# Altium schematic sheet Main.SchDoc
size A4
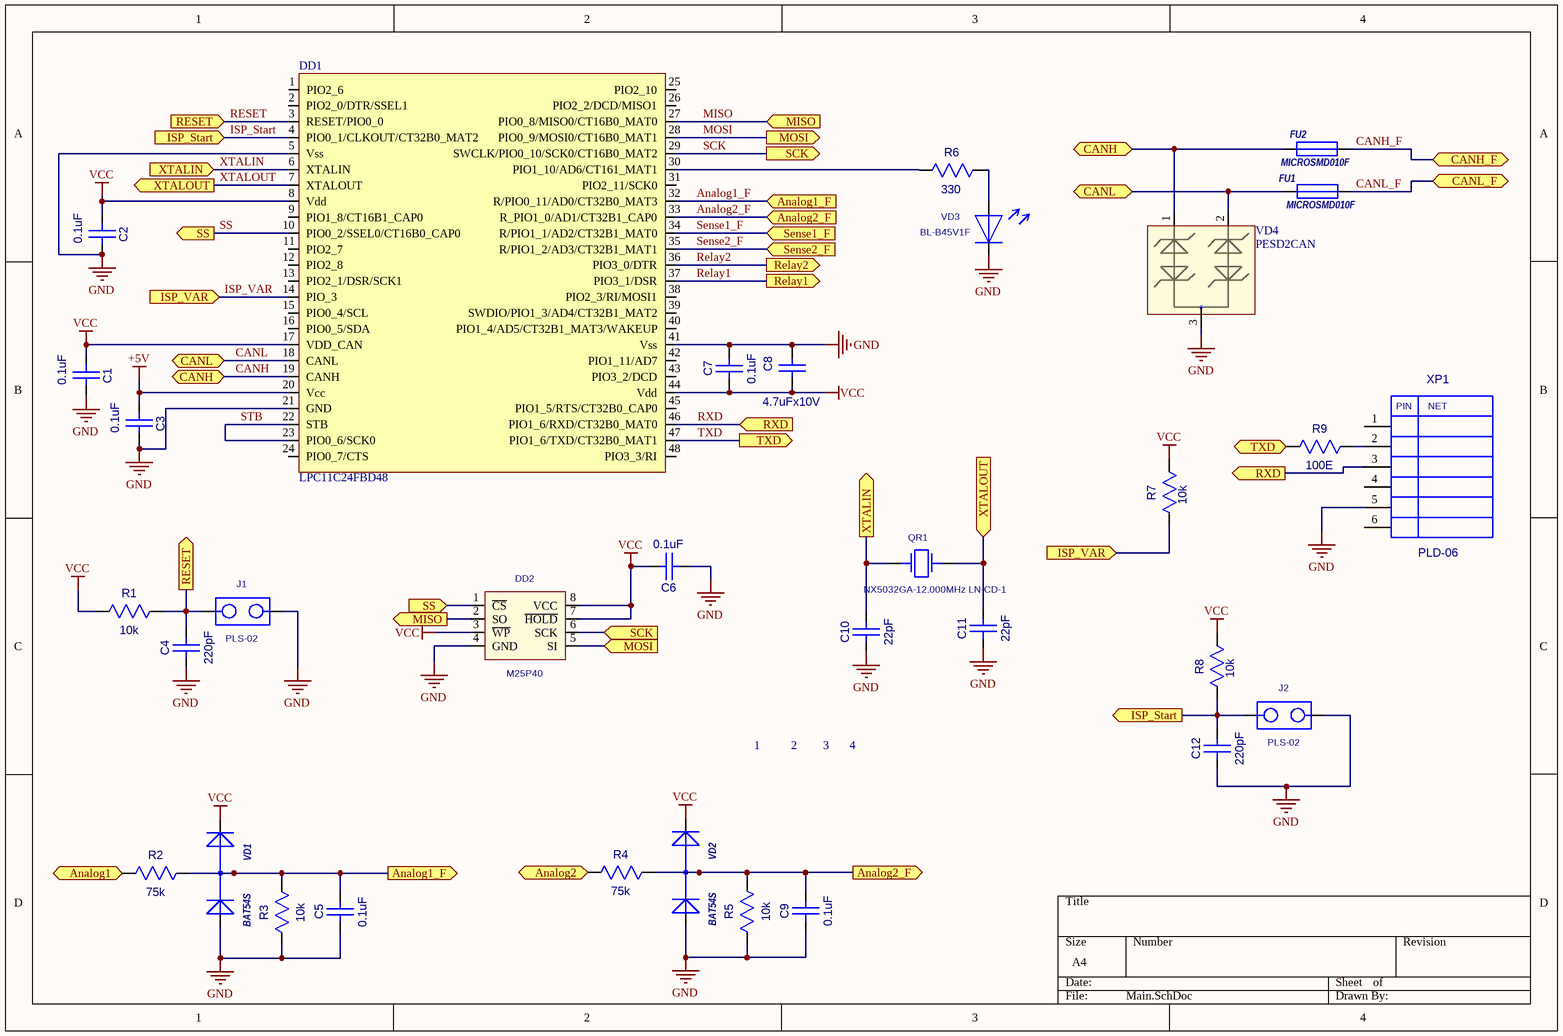
[diagram p0: Main.SchDoc]

## Parts
1  REPER1.2  [REPER1.2]  (value not drawn)
2  REPER1.2  [REPER1.2]  (value not drawn)
3  REPER1.2  [REPER1.2]  (value not drawn)
4  REPER1.2  [REPER1.2]  (value not drawn)
C1  0.1uF  [CC0603-3M]
C2  0.1uF  [CC0603-3M]
C3  0.1uF  [CC0603-3M]
C4  220pF  [CC0603-3M]
C5  0.1uF  [CC0603-3M]
C6  0.1uF  [CC0603-3M]
C7  0.1uF  [CC0603-3M]
C8  4.7uFx10V  [CC0805-MIDI-2M1]
C9  0.1uF  [CC0603-3M]
C10  22pF  [CC0603-3M]
C11  22pF  [CC0603-3M]
C12  220pF  [CC0603-3M]
DD1  LPC11C24FBD48  [LQFP-48]
DD2  M25P40  [EIAJ_SO8]
FU1  MICROSMD010F  [RC1210]
FU2  MICROSMD010F  [RC1210]
J1  PLS-02  [PLS-02]
J2  PLS-02  [PLS-02]
QR1  NX5032GA-12.000MHz LN-CD-1  [AC5032_2]
R1  10k  [RC0603-3M]
R2  75k  [RC0603-3M]
R3  10k  [RC0603-3M]
R4  75k  [RC0603-3M]
R5  10k  [RC0603-3M]
R6  330  [RC0603-3M]
R7  10k  [RC0603-3M]
R8  10k  [RC0603-3M]
R9  100E  [RC0603-3M]
VD1  BAT54S  [SOT-23(GSD)]
VD2  BAT54S  [SOT-23(GSD)]
VD3  BL-B45V1F  [LED3]
VD4  PESD2CAN  [SOT-23(123)]
XP1  PLD-06  [PIN6]

## Ports
Analog1 (in), Analog1_F (in), Analog1_F (out), Analog2 (in), Analog2_F (in), Analog2_F (out), CANH, CANH_F, CANL, CANL_F, ISP_Start (in), ISP_Start (out), ISP_VAR (in), MISO (in), MISO (out), MOSI (in), MOSI (out), Relay1 (out), Relay2 (out), RESET (in), RESET (out), RXD (in), RXD (out), SCK (in), SCK (out), Sense1_F (in), Sense2_F (in), SS (in), SS (out), TXD (in), TXD (out), XTALIN (in), XTALIN (out), XTALOUT (in), XTALOUT (out)

## Nets
+5V: C3.1(A) DD1.20(Vcc)
GND: C1.2(B) C2.2(B) C3.2(B) C4.1(A) C5.1(A) C6.1(A) C7.2(B) C8.2(B) C9.1(A) C10.1(A) C11.1(A) C12.1(A) DD1.5(Vss) DD1.21(GND) DD1.41(Vss) DD2.4(GND) J1.2 J2.2 R3.1(A) R5.1(A) VD1.1(A) VD2.1(A) VD3.1 VD4.3 XP1.5
VCC: C1.1(A) C2.1(A) C6.2(B) C7.1(A) C8.1(A) DD1.8(Vdd) DD1.17(VDD_CAN) DD1.44(Vdd) DD2.3(~{WP}) DD2.7(~{HOLD}) DD2.8(VCC) R1.1(A) R7.2(B) R8.2(B) VD1.2(K) VD2.2(K)
Analog1: R2.1(A) ; port Analog1
Analog1_F: C5.2(B) DD1.32(R/PIO0_11/AD0/CT32B0_MAT3) R2.2(B) R3.2(B) VD1.3(AK) ; port Analog1_F
Analog2: R4.1(A) ; port Analog2
Analog2_F: C9.2(B) DD1.33(R_PIO1_0/AD1/CT32B1_CAP0) R4.2(B) R5.2(B) VD2.3(AK) ; port Analog2_F
CANH: DD1.19(CANH) FU2.1 VD4.1 ; port CANH
CANH_F: FU2.2 ; port CANH_F
CANL: DD1.18(CANL) FU1.1 VD4.2 ; port CANL
CANL_F: FU1.2 ; port CANL_F
ISP_Start: C12.2(B) DD1.4(PIO0_1/CLKOUT/CT32B0_MAT2) J2.1 R8.1(A) ; port ISP_Start
ISP_VAR: DD1.14(PIO_3) R7.1(A) ; port ISP_VAR
MISO: DD1.27(PIO0_8/MISO0/CT16B0_MAT0) DD2.2(SO) ; port MISO
MOSI: DD1.28(PIO0_9/MOSI0/CT16B0_MAT1) DD2.5(SI) ; port MOSI
Relay1: DD1.37(PIO3_1/DSR) ; port Relay1
Relay2: DD1.36(PIO3_0/DTR) ; port Relay2
RESET: C4.2(B) DD1.3(RESET/PIO0_0) J1.1 R1.2(B) ; port RESET
RXD: DD1.46(PIO1_6/RXD/CT32B0_MAT0) XP1.3 ; port RXD
SCK: DD1.29(SWCLK/PIO0_10/SCK0/CT16B0_MAT2) DD2.6(SCK) ; port SCK
Sense1_F: DD1.34(R/PIO1_1/AD2/CT32B1_MAT0) ; port Sense1_F
Sense2_F: DD1.35(R/PIO1_2/AD3/CT32B1_MAT1) ; port Sense2_F
SS: DD1.10(PIO0_2/SSEL0/CT16B0_CAP0) DD2.1(~{CS}) ; port SS
STB: DD1.22(STB) DD1.23(PIO0_6/SCK0)
TXD: DD1.47(PIO1_6/TXD/CT32B0_MAT1) R9.1(A) ; port TXD
XTALIN: C10.2(B) DD1.6(XTALIN) QR1.1 ; port XTALIN
XTALOUT: C11.2(B) DD1.7(XTALOUT) QR1.2 ; port XTALOUT
NetDD1_30: DD1.30(PIO1_10/AD6/CT161_MAT1) R6.1(A)
NetR6_2: R6.2(B) VD3.2
NetR9_2: R9.2(B) XP1.2

Not connected (* = marked no-connect by the designer): 1 1; 2 1; 3 1; 4 1; DD1 1(PIO2_6) 2(PIO2_0/DTR/SSEL1) 9(PIO1_8/CT16B1_CAP0) 11(PIO2_7) 12(PIO2_8) 13(PIO2_1/DSR/SCK1) 15(PIO0_4/SCL) 16(PIO0_5/SDA) 24(PIO0_7/CTS) 25(PIO2_10) 26(PIO2_2/DCD/MISO1) 31(PIO2_11/SCK0) 38(PIO2_3/RI/MOSI1) 39(SWDIO/PIO1_3/AD4/CT32B1_MAT2) 40(PIO1_4/AD5/CT32B1_MAT3/WAKEUP) 42(PIO1_11/AD7) 43(PIO3_2/DCD) 45(PIO1_5/RTS/CT32B0_CAP0) 48(PIO3_3/RI); XP1 1 4 6

## Notes on the sheet
- (in symbol PLD-06) PIN; NET

## Library data of the parts
C1-C7 C9-C12 = CC0603
  C1-C3 C5-C7 C9: Value: 0.1uF
  C4 C12: Value: 220pF
  C10 C11: Value: 22pF
C8 = CC0805: Value: 4.7uFx10V
DD2 = S25FL016A0LMFI01: Value: M25P40
FU1 FU2 = MICROSMD: Value: MICROSMD010F
QR1 = AC5032_2: AC5032/2; Value: NX5032GA-12.000MHz LN-CD-1
R1-R9 = RC0603
  R1 R3 R5 R7 R8: Value: 10k
  R2 R4: Value: 75k
  R6: Value: 330
  R9: Value: 100E
VD1 VD2 = BAT54S: 1.0 Ampere General Purpose Rectifier; ComponentField6: Published 8-Jun-2000, Modified 11-July-2000: SIM Model Added.; Value: *
VD3 = LED_3: Value: *
VD4 = PESD2CAN: TVS for CAN
XP1 = PLD-06: PLD06; Value: *
1-4 = REPER1.2: Value: *
DD1 = LPC11C24FBD48: Value: LPC11C24FBD48
J1 J2 = PLS-02: Value: PLS-02